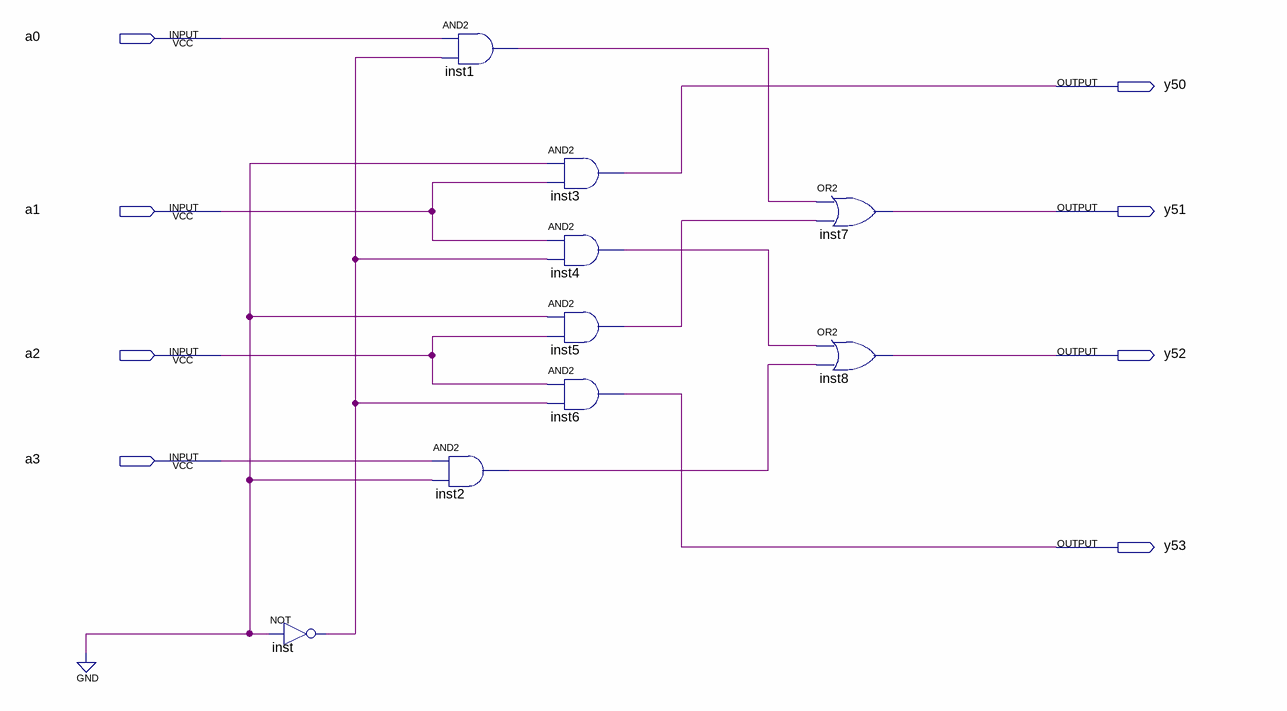
[diagram p0: schematic sheet]
// Quartus schematic left.bdf as structural Verilog: 9 symbols, 8 pins
module left (
  input  a0,
  input  a1,
  input  a2,
  input  a3,
  output y50,
  output y51,
  output y52,
  output y53
);

  wire inst1_out, inst2_out, inst4_out, inst5_out, inst_out;

  not inst (inst_out, 1'b0);
  and inst1 (inst1_out, a0, inst_out);
  and inst2 (inst2_out, a3, 1'b0);
  and inst3 (y50, 1'b0, a1);
  and inst4 (inst4_out, a1, inst_out);
  and inst5 (inst5_out, 1'b0, a2);
  and inst6 (y53, a2, inst_out);
  or inst7 (y51, inst1_out, inst5_out);
  or inst8 (y52, inst4_out, inst2_out);
endmodule
